# Altium schematic sheet Sincronismo.SchDoc: GRUPO ALTECH
size A3; DocumentNumber: GA0070; SheetNumber: 2; SheetTotal: 4; PageSetup: Record=PageOptions|CenterHorizontal=True|CenterVertical=True|PrintScale=0.71|XCorrection=1.00|YCorrection=1.00|PrintKind=0|BorderSize=5000000|LeftOffset=0|BottomOffset=0|Orientation=2|PaperLength=1000|PaperWidth=1000|Scale=100|PaperSource=7|PrintQuality=-3|MediaType=1|DitherType=10|PrintScaleMode=1|PaperKind=A4|PaperIndex=9
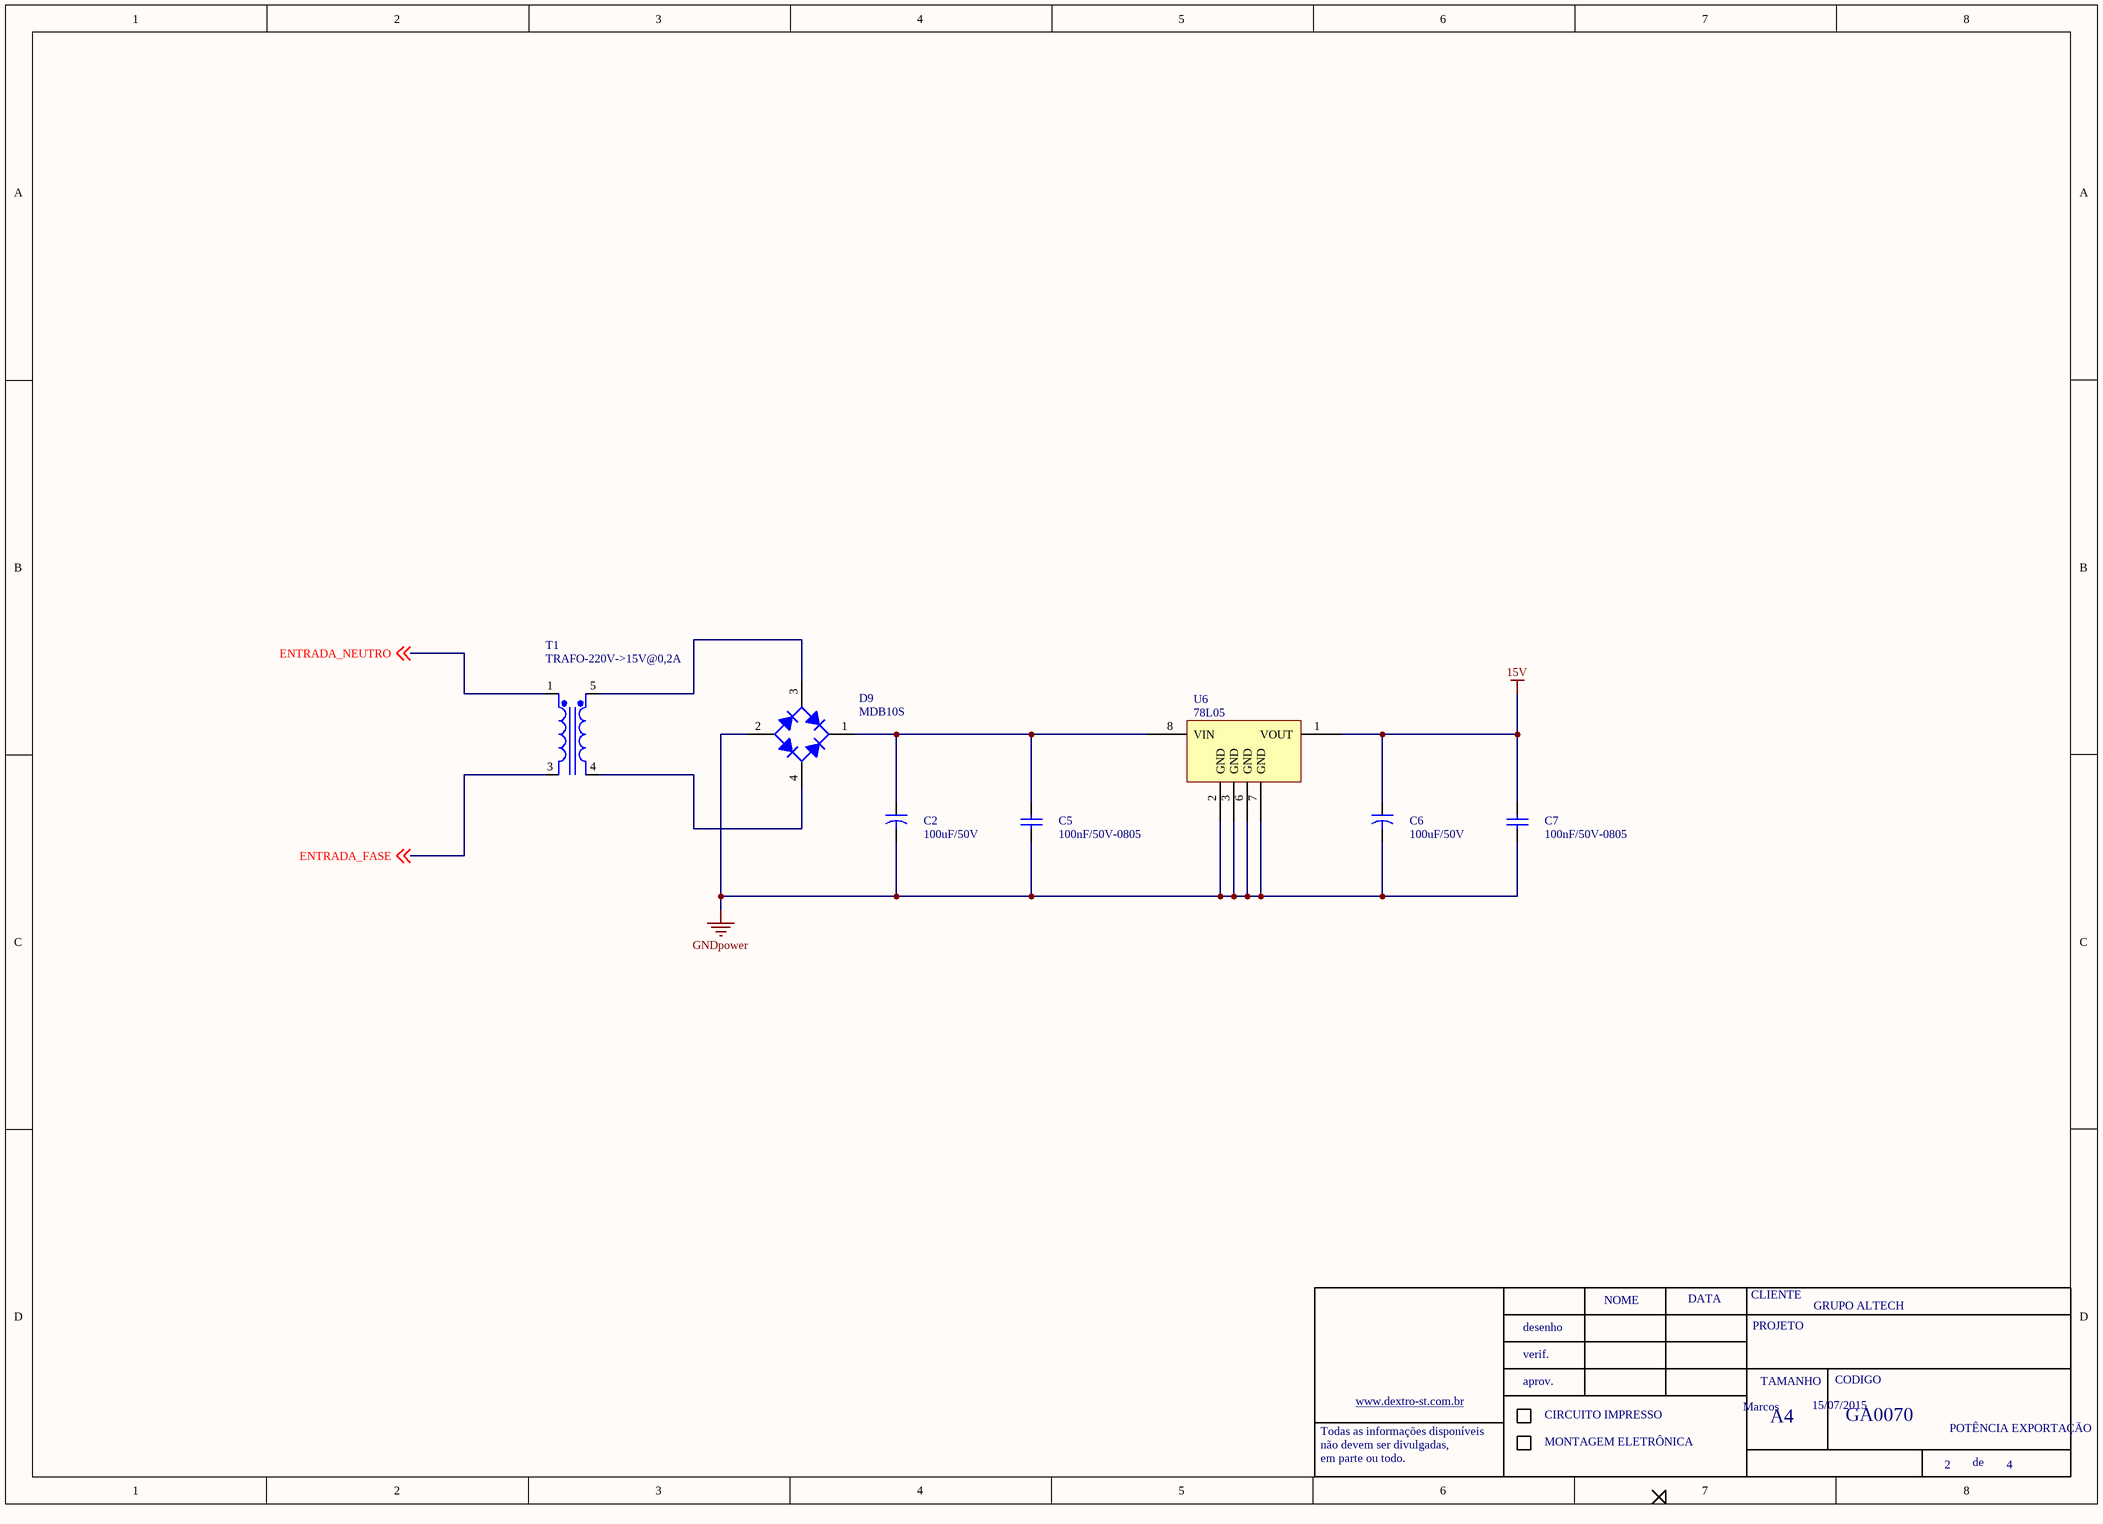
[diagram p0: Sincronismo.SchDoc]

## Parts
C2  100uF/50V  [CAP POL 8x12mm]
C5  100nF/50V-0805  [0805-REVISADO ONDA]
C6  100uF/50V  [CAP POL 8x12mm]
C7  100nF/50V-0805  [0805-REVISADO ONDA]
D9  MDB10S  [MICRO DIP MDB10S]
T1  TRAFO-220V->15V@0,2A
U6  78L05  [SOIC-08]

## Nets
15V: C6.1 C7.2 U6.1(VOUT)
GNDpower: C2.2 C5.1 C6.2 C7.1 D9.2(A) U6.2(GND) U6.3(GND) U6.6(GND) U6.7(GND)
ENTRADA_FASE: T1.3 ; off-sheet ENTRADA_FASE
ENTRADA_NEUTRO: T1.1 ; off-sheet ENTRADA_NEUTRO
NetC2_1: C2.1 C5.2 D9.1(K) U6.8(VIN)
NetD9_3: D9.3(C) T1.5
NetD9_4: D9.4(C) T1.4

## Notes on the sheet
- Marcos
- 15/07/2015
- POTÊNCIA EXPORTAÇÃO
- NOME
- DATA
- CLIENTE
- PROJETO
- desenho
- verif.
- aprov.
- TAMANHO
- CODIGO
- Todas as informações disponíveis
- não devem ser divulgadas,
- em parte ou todo.
- www.dextro-st.com.br
- CIRCUITO IMPRESSO
- MONTAGEM ELETRÔNICA
- A4
- de

## Library data of the parts
C5 C7 = 100nF/50-0805-NPO: ERP: 104.11.005
T1 = TRAFO CORRENTE: TRAFO CORRENTE 1A-5V; ERP: 210.00.006
U6 = 78L05-SOIC
C2 C6 = 100uF/50V: ERP: 105.01.003